# EAGLE design MicroCounter (EAGLE 9.6.2)
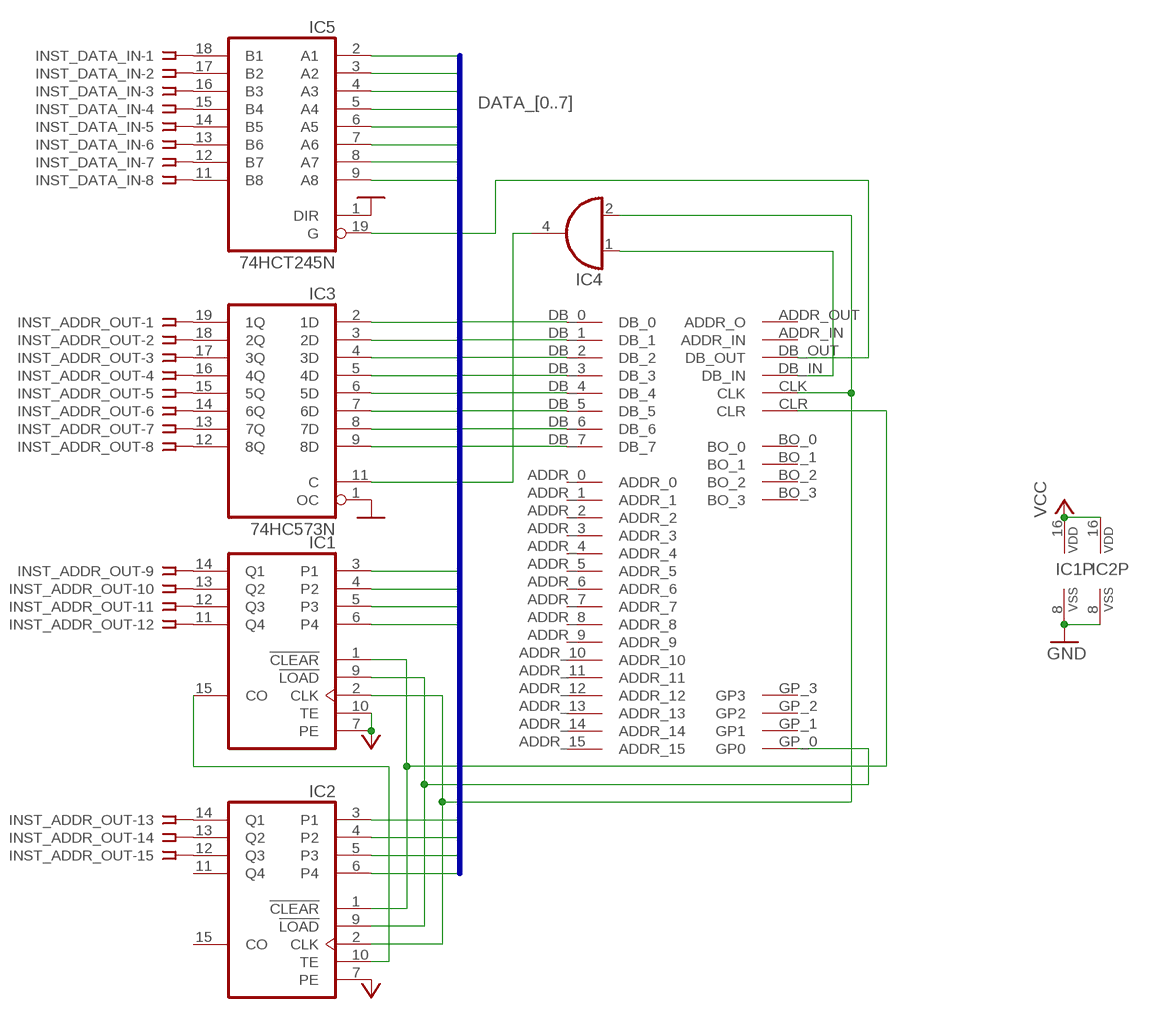
[diagram p0: schematic, sheet 1]

## Parts
IC1  4161N  [DIL16]
IC2  4161N  [DIL16]
IC3  74HC573N  [DIL20]
IC4  74LVC1G08DCK  [SC70-5]
IC5  74HCT245N  [DIL20]
INST_ADDR_OUT  SSW-115-02-G-S  [SSW-115-02-G-S]
INST_DATA_IN  SSW-108-02-G-S  [SSW-108-02-G-S]
U$1  BACKPLATE_INTERFACEEDGE_FINGER  [BACK_INTERFACE-FOOT]

## Nets
DATA_0: IC1.3(P1) IC3.2(1D) IC5.2(A1) U$1.DB_0
DATA_1: IC1.4(P2) IC3.3(2D) IC5.3(A2) U$1.DB_1
DATA_2: IC1.5(P3) IC3.4(3D) IC5.4(A3) U$1.DB_2
DATA_3: IC1.6(P4) IC3.5(4D) IC5.5(A4) U$1.DB_3
DATA_4: IC2.3(P1) IC3.6(5D) IC5.6(A5) U$1.DB_4
DATA_5: IC2.4(P2) IC3.7(6D) IC5.7(A6) U$1.DB_5
DATA_6: IC2.5(P3) IC3.8(7D) IC5.8(A7) U$1.DB_6
DATA_7: IC2.6(P4) IC3.9(8D) IC5.9(A8) U$1.DB_7
GND: IC1.8(VSS) IC2.8(VSS) IC3.1(OC) IC5.1(DIR)
N$1: IC3.19(1Q) INST_ADDR_OUT.1
N$2: IC5.18(B1) INST_DATA_IN.1
N$3: IC5.17(B2) INST_DATA_IN.2
N$4: IC5.16(B3) INST_DATA_IN.3
N$5: IC5.15(B4) INST_DATA_IN.4
N$6: IC3.18(2Q) INST_ADDR_OUT.2
N$7: IC5.14(B5) INST_DATA_IN.5
N$8: IC5.13(B6) INST_DATA_IN.6
N$9: IC5.12(B7) INST_DATA_IN.7
N$10: IC5.11(B8) INST_DATA_IN.8
N$11: IC3.17(3Q) INST_ADDR_OUT.3
N$12: IC3.16(4Q) INST_ADDR_OUT.4
N$13: IC3.15(5Q) INST_ADDR_OUT.5
N$14: IC3.14(6Q) INST_ADDR_OUT.6
N$15: IC3.13(7Q) INST_ADDR_OUT.7
N$16: IC3.12(8Q) INST_ADDR_OUT.8
N$17: IC1.14(Q1) INST_ADDR_OUT.9
N$18: IC1.13(Q2) INST_ADDR_OUT.10
N$19: IC1.12(Q3) INST_ADDR_OUT.11
N$20: IC1.11(Q4) INST_ADDR_OUT.12
N$21: IC2.14(Q1) INST_ADDR_OUT.13
N$22: IC2.13(Q2) INST_ADDR_OUT.14
N$23: IC2.12(Q3) INST_ADDR_OUT.15
N$24: IC3.11(C) IC4.4(O)
N$25: IC1.15(CO) IC2.10(TE)
N$26: IC4.1(I0) U$1.DB_IN
N$27: IC5.19(G) U$1.DB_OUT
N$28: IC1.1(!CLEAR) IC2.1(!CLEAR) U$1.CLR
N$29: IC1.2(CLK) IC2.2(CLK) IC4.2(I1) U$1.CLK
SUB_LOAD: IC1.9(!LOAD) IC2.9(!LOAD) U$1.GP_0(GP0)
VCC: IC1.7(PE) IC1.10(TE) IC1.16(VDD) IC2.7(PE) IC2.16(VDD)
Unconnected: IC2.11(Q4) IC2.15(CO) U$1.ADDR_0 U$1.ADDR_1 U$1.ADDR_2 U$1.ADDR_3 U$1.ADDR_4 U$1.ADDR_5 U$1.ADDR_6 U$1.ADDR_7 U$1.ADDR_8 U$1.ADDR_9 U$1.ADDR_10 U$1.ADDR_11 U$1.ADDR_12 U$1.ADDR_13 U$1.ADDR_14 U$1.ADDR_15 U$1.ADDR_IN U$1.ADDR_OUT(ADDR_O) U$1.BO_0 U$1.BO_1 U$1.BO_2 U$1.BO_3 U$1.GP_1(GP1) U$1.GP_2(GP2) U$1.GP_3(GP3) U$1.NC_0 U$1.NC_1 U$1.NC_2 U$1.NC_3 U$1.NC_4 U$1.NC_5 U$1.NC_6 U$1.NC_7 U$1.NC_8 U$1.NC_9 U$1.NC_10 U$1.NC_11 U$1.NC_12 U$1.NC_13 U$1.NC_14 U$1.NC_15 U$1.NC_16 U$1.NC_17 U$1.NC_18 U$1.NC_19 U$1.NC_20 U$1.NC_21

## Buses
DATA_[0..7]

## Power pins joined to a net without a drawn wire
GND: IC3.10(GND) IC4.3(GND) IC5.10(GND) U$1.GND_0(GND) U$1.GND_1(GND)
VCC: IC3.20(VCC) IC4.5(VCC) IC5.20(VCC) U$1.VCC_0(VCC) U$1.VCC_1(VCC)

## Library data of the parts
IC1 IC2 = 40xx:4161: Synchronous presettable 4-bit binary COUNTER
IC3 = 74xx-eu:74*573: 8-bit D latch BUS DRIVER
IC4 = 74xx-little-de:74*1G08: 2-input AND gate
IC5 = 74xx-eu:74*245: Octal BUS TRANSCEIVER, 3-state
INST_ADDR_OUT = con-samtec:SSW-115-02-G-S: THROUGH-HOLE .025" SQ POST SOCKET Source: Samtec SSW.pdf; MF: Samtec Inc.; MPN: SSW-115-02-G-S; OC_FARNELL: unknown; OC_NEWARK: 11P9564
INST_DATA_IN = con-samtec:SSW-108-02-G-S: THROUGH-HOLE .025" SQ POST SOCKET Source: Samtec SSW.pdf; MF: Samtec Inc.; MPN: SSW-108-02-G-S; OC_FARNELL: unknown; OC_NEWARK: 11P9448
U$1 = Computer:BACKPLATE_INTERFACE

## Board
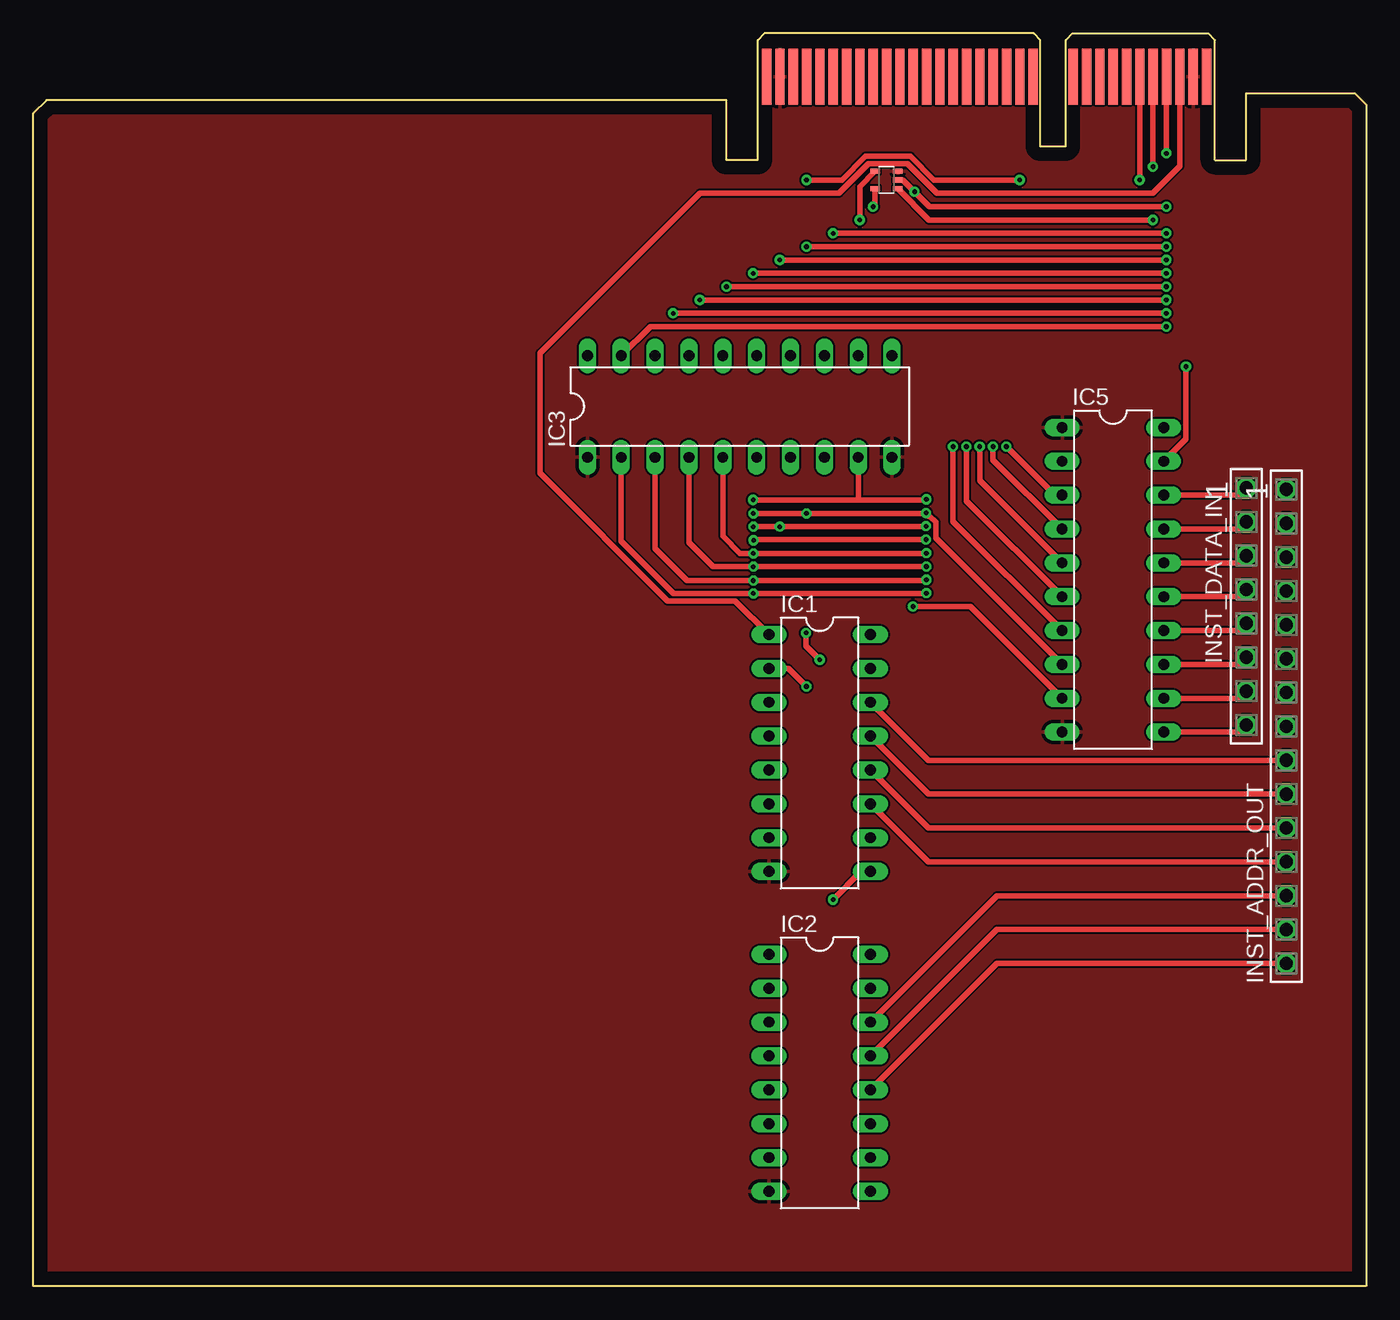
[diagram p1: board, top side]
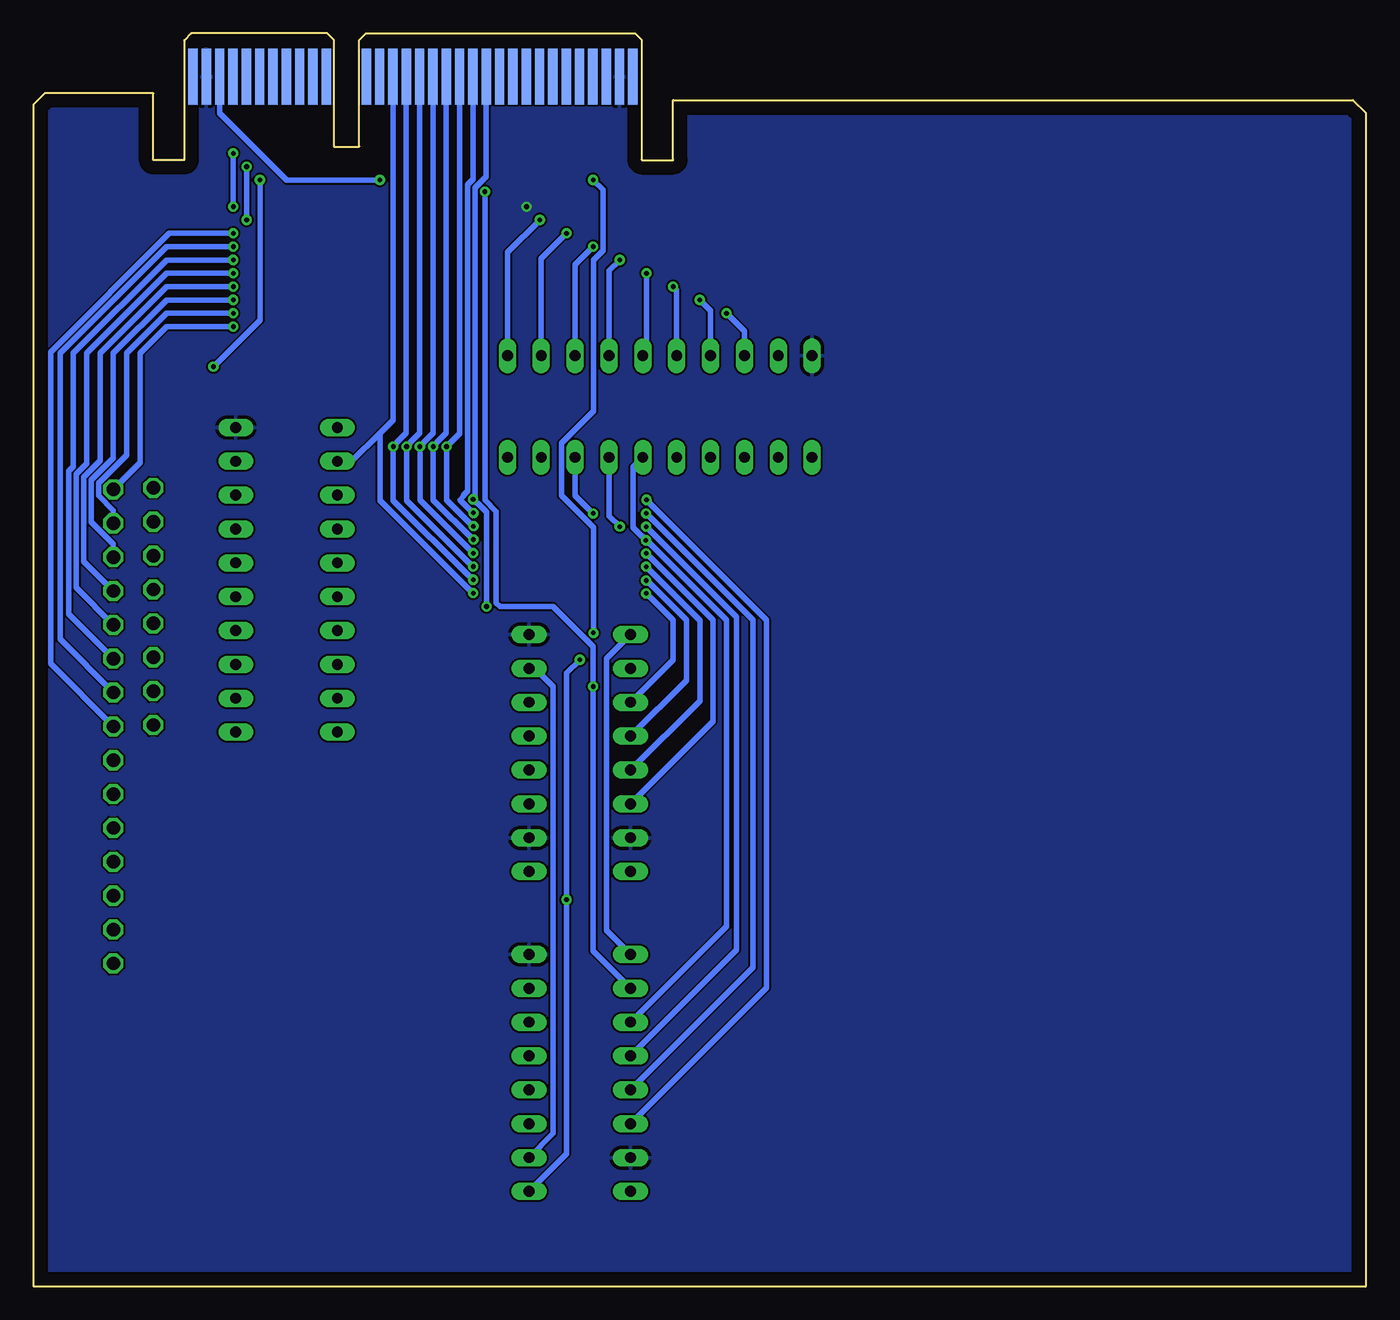
[diagram p2: board, bottom side, seen from below]

Size 100 x 94 mm. Coordinates in mm from the lower left corner, seen from the top.
Outline: 0,0 0,88 1,89 52,89 52,84.5 54.35,84.5 54.35,93.5 54.85,94 75.05,94 75.55,93.5 75.55,85.5 77.45,85.5 77.45,93.5 77.95,94 88.15,94 88.65,93.5 88.65,84.5 91,84.5 91,89.5 99.15,89.5 100,88.65 100,0 0,0
Copper layers (1*16): Top 0.035mm / dielectric 1.5mm / Bottom 0.035mm
Design rules "default *": minimum track width 16mil, minimum drill 0.35mm, track to track 6mil, track to pad 6mil, pad to pad 6mil, via to via 6mil, smd to smd 6mil, copper to edge 40mil, drill to drill 6mil, minimum pad ring 10mil, minimum via ring 8mil, stop-mask expansion 4mil, vias tented up to drill 0mil, thermal gap 10mil

### Footprints (pad centres in the part's own frame; a part is rotated, then mirrored left to right if it is on the bottom)
DIL16 = drill 0.813 long: 1 -8.89,-3.81; 2 -6.35,-3.81; 3 -3.81,-3.81; 4 -1.27,-3.81; 5 1.27,-3.81; 6 3.81,-3.81; 7 6.35,-3.81; 8 8.89,-3.81; 9 8.89,3.81; 10 6.35,3.81; 11 3.81,3.81; 12 1.27,3.81; 13 -1.27,3.81; 14 -3.81,3.81; 15 -6.35,3.81; 16 -8.89,3.81
DIL20 = drill 0.813 long: 1 -11.43,-3.81; 2 -8.89,-3.81; 3 -6.35,-3.81; 4 -3.81,-3.81; 5 -1.27,-3.81; 6 1.27,-3.81; 7 3.81,-3.81; 8 6.35,-3.81; 9 8.89,-3.81; 10 11.43,-3.81; 11 11.43,3.81; 12 8.89,3.81; 13 6.35,3.81; 14 3.81,3.81; 15 1.27,3.81; 16 -1.27,3.81; 17 -3.81,3.81; 18 -6.35,3.81; 19 -8.89,3.81; 20 -11.43,3.81
SC70-5 = smd 0.4 x 0.7: 1 -0.65,-0.85; 2 0,-0.85; 3 0.65,-0.85; 4 0.65,0.85; 5 -0.65,0.85
SSW-115-02-G-S = drill 1 pad 1.5 octagon: 1 -17.78,0; 2 -15.24,0; 3 -12.7,0; 4 -10.16,0; 5 -7.62,0; 6 -5.08,0; 7 -2.54,0; 8 0,0; 9 2.54,0; 10 5.08,0; 11 7.62,0; 12 10.16,0; 13 12.7,0; 14 15.24,0; 15 17.78,0
SSW-108-02-G-S = drill 1 pad 1.5 octagon: 1 -8.89,0; 2 -6.35,0; 3 -3.81,0; 4 -1.27,0; 5 1.27,0; 6 3.81,0; 7 6.35,0; 8 8.89,0
BACK_INTERFACE-FOOT = smd 0.7 x 4.2: ADDR_0 17.02,0; ADDR_1 16.02,0; ADDR_2 15.02,0; ADDR_3 14.02,0; ADDR_4 13.02,0; ADDR_5 12.02,0; ADDR_6 11.02,0; ADDR_7 10.02,0; ADDR_8 9.02,0; ADDR_9 8.02,0; ADDR_10 7.02,0; ADDR_11 6.02,0; ADDR_12 5.02,0; ADDR_13 4.02,0; ADDR_14 3.02,0; ADDR_15 2.02,0; ADDR_IN 27.02,0; ADDR_OUT 26.02,0; CLK 30.02,0; CLR 31.02,0; DB_IN 29.02,0; DB_OUT 28.02,0; GND_0 32.02,0; GND_1 1.02,0; NC_0 33.02,0; NC_1 25.02,0; NC_2 24.02,0; NC_3 23.02,0; NC_4 20.02,0; NC_5 19.02,0; NC_6 18.02,0; NC_7 0.02,0 | smd 0.7 x 4.2 bottom: BO_0 27.02,0; BO_1 26.02,0; BO_2 25.02,0; BO_3 24.02,0; DB_0 18.02,0; DB_1 17.02,0; DB_2 16.02,0; DB_3 15.02,0; DB_4 14.02,0; DB_5 13.02,0; DB_6 12.02,0; DB_7 11.02,0; GP_0 31.02,0; GP_1 30.02,0; GP_2 29.02,0; GP_3 28.02,0; NC_8 33.02,0; NC_9 23.02,0; NC_10 20.02,0; NC_11 19.02,0; NC_12 10.02,0; NC_13 9.02,0; NC_14 8.02,0; NC_15 7.02,0; NC_16 6.02,0; NC_17 5.02,0; NC_18 4.02,0; NC_19 3.02,0; NC_20 2.02,0; NC_21 0.02,0; VCC_0 32.02,0; VCC_1 1.02,0

### Placement (x,y rotation side)
IC1  59,40 270 top
IC2  59,16 270 top
IC3  53,66 0 top
IC4  64,83 90 top
IC5  81,53 270 top
INST_ADDR_OUT  94,42 270 top
INST_DATA_IN  91,51 270 top
U$1  55,90.75 0 top

### Tracks (layer width: path | path; a pad name or v marks a point on that pad's centre or on a via)
DATA_0  (via drill 0.35)
  Top 0.406: v67,52 66.98,51.98 v54.02,51.98 48.02,51.98 44.11,55.89 IC3.2
  Bottom 0.406: 74,64 74,58.96 67.3,52.27 67.27,52.27 v67,52 | IC1.3 52,47 52,50 53.98,51.98 v54.02,51.98 | IC5.2 76.11,61.89 74,64 | 74,64 73.02,64.98 U$1.DB_0
DATA_1  (via drill 0.35)
  Top 0.406: v67,53 66.94,52.94 v54.02,52.94 49.06,52.94 46.65,55.35 IC3.3 | IC5.3 76.65,59.35 v73,63
  Bottom 0.406: IC1.4 51,45.46 51,50 53.98,52.98 v54.02,52.94 | v67,53 67.27,53.27 67.3,53.27 73,58.96 v73,63 72.73,63.27 72.73,63.3 72.02,64.02 U$1.DB_1
DATA_2  (via drill 0.35)
  Top 0.406: v67,54 54.04,54 | 54.04,54 v54.02,53.98 | IC3.4 49.19,55.81 51,54 54.04,54 | IC5.4 72,62 v72,63
  Bottom 0.406: 55.19,39.17 IC1.5 50,43.92 50,49.96 v54.02,53.98 | v67,54 67.27,54.27 67.3,54.27 72,58.96 v72,63 71.73,63.27 71.73,63.3 71.02,64.02 U$1.DB_2
DATA_3  (via drill 0.35)
  Top 0.406: v67,55 66.98,54.98 v54.02,54.98 53.02,54.98 51.73,56.27 IC3.5 | IC5.5 71,60.46 v71,63
  Bottom 0.406: IC1.6 49,42.38 49,50 53.98,54.98 v54.02,54.98 | v67,55 71,59 v71,63 70.73,63.27 70.73,63.3 70.02,64.02 U$1.DB_3
DATA_4  (via drill 0.35)
  Top 0.406: v54.04,55.96 54.09,56.02 v66.98,56.02 | IC5.6 70,58.92 v70,63
  Bottom 0.406: IC2.3 48,27 48,50 53.96,55.96 | 66.94,56.02 v66.98,56.02 67.02,56.02 70,59 v70,63 69.73,63.27 69.73,63.3 69.02,64.02 U$1.DB_4 | 53.96,55.96 v54.04,55.96 | IC3.6 55,61.46 55,56.92 54.32,56.25 54.25,56.25 53.96,55.96
DATA_5  (via drill 0.35)
  Top 0.406: v66.98,57.02 66.94,56.98 v56,56.98 v54.02,56.98 | IC5.7 69,57.38 v69,63
  Bottom 0.406: IC2.4 47.23,25.23 47.23,50.19 v54.02,56.98 | v66.98,57.02 67,57 69,59 v69,63 68.02,63.98 U$1.DB_5 | IC3.7 56.81,57.79 v56,56.98
DATA_6  (via drill 0.35)
  Top 0.406: v54.02,57.98 v58,57.98 66.94,57.98 v66.98,58.02 67.25,57.75 67.28,57.75 67.72,57.32 67.72,56.12 IC5.8
  Bottom 0.406: IC2.5 46,23.92 46,50 53.98,57.98 v54.02,57.98 | v66.98,58.02 67.02,58.02 68,59 67.73,59.27 67.73,59.34 67.41,59.67 67.41,82.65 67.02,83.05 U$1.DB_6 | IC3.8 59.35,59.33 v58,57.98
DATA_7  (via drill 0.35)
  Top 0.406: v67,59.04 66.96,59 62,59 | 62,59 v54,59 | IC3.9 61.89,59.11 62,59 | IC5.9 70.3,51 v66,51
  Bottom 0.406: v54,59 45,50 45,22.38 IC2.6 | v66,51 66,58.08 66.68,58.75 66.75,58.75 67.02,59.02 v67,59.04 66.85,59.19 66.85,82.42 66.02,83.25 U$1.DB_7
GND
  pour Top: 0,88 1,89 52,89 52,84.5 54.35,84.5 54.35,93.5 54.85,94 75.05,94 75.55,93.5 75.55,85.5 77.45,85.5 77.45,93.5 77.95,94 88.15,94 88.65,93.5 88.65,84.5 91,84.5 91,89.5 99.15,89.5 100,88.65 100,0 0,0
N$1  (via drill 0.35)
  Top 0.406: IC3.19 46.3,72 v85,72
  Bottom 0.406: INST_ADDR_OUT.1 92,61.78 92,70 90,72 v85,72
N$2
  Top 0.406: INST_DATA_IN.1 90.46,59.35 IC5.18
N$3
  Top 0.406: INST_DATA_IN.2 90.46,56.81 IC5.17
N$4
  Top 0.406: INST_DATA_IN.3 90.46,54.27 IC5.16
N$5
  Top 0.406: INST_DATA_IN.4 90.46,51.73 IC5.15
N$6  (via drill 0.35)
  Top 0.406: v85,73 v48,73
  Bottom 0.406: INST_ADDR_OUT.2 94,58.21 95.11,59.32 95.11,60.24 93,62.35 93,70 90,73 v85,73 | v48,73 46.65,71.65 IC3.18
N$7
  Top 0.406: INST_DATA_IN.5 90.46,49.19 IC5.14
N$8
  Top 0.406: INST_DATA_IN.6 90.46,46.65 IC5.13
N$9
  Top 0.406: INST_DATA_IN.7 90.46,44.11 IC5.12
N$10
  Top 0.406: INST_DATA_IN.8 90.46,41.57 IC5.11
N$11  (via drill 0.35)
  Top 0.406: v85,74 v50,74
  Bottom 0.406: INST_ADDR_OUT.3 94,55.67 95.67,57.34 95.67,60.47 94,62.14 94,70 90,74 v85,74 | v50,74 49.19,73.19 IC3.17
N$12  (via drill 0.35)
  Top 0.406: v85,75 v52,75
  Bottom 0.406: INST_ADDR_OUT.4 96.23,54.39 96.23,60.7 95,61.93 95,70 90,75 v85,75 | v52,75 51.73,74.73 IC3.16
N$13  (via drill 0.35)
  Top 0.406: v85,76 v54,76
  Bottom 0.406: INST_ADDR_OUT.5 96.79,52.41 96.79,60.93 96,61.72 96,70 90,76 v85,76 | v54,76 54,70.08 IC3.15
N$14  (via drill 0.35)
  Top 0.406: v56,77 v85,77
  Bottom 0.406: INST_ADDR_OUT.6 97.34,50.42 97.34,61.16 97,61.51 97,70 90,77 v85,77 | v56,77 56.81,76.19 IC3.14
N$15  (via drill 0.35)
  Top 0.406: v85,78 v58,78
  Bottom 0.406: INST_ADDR_OUT.7 98,48.54 98,70 90,78 v85,78 | v58,78 59.35,76.65 IC3.13
N$16  (via drill 0.35)
  Top 0.406: v60,79 v85,79
  Bottom 0.406: INST_ADDR_OUT.8 98.7,46.7 98.7,70.09 89.79,79 v85,79 | v60,79 61.89,77.11 IC3.12
N$17
  Top 0.406: INST_ADDR_OUT.9 67.16,39.46 IC1.14
N$18
  Top 0.406: INST_ADDR_OUT.10 67.16,36.92 IC1.13
N$19
  Top 0.406: INST_ADDR_OUT.11 67.16,34.38 IC1.12
N$20
  Top 0.406: INST_ADDR_OUT.12 67.16,31.84 IC1.11
N$21
  Top 0.406: INST_ADDR_OUT.13 72.3,29.3 IC2.14
N$22
  Top 0.406: INST_ADDR_OUT.14 72.3,26.76 IC2.13
N$23
  Top 0.406: INST_ADDR_OUT.15 72.3,24.22 IC2.12
N$24  (via drill 0.35)
  Top 0.406: v62,80 62,82.5 IC4.4
  Bottom 0.406: IC3.11 64.43,77.57 v62,80
N$25
  Bottom 0.406: IC2.10 61,11.46 61,45 62.35,46.35 IC1.15
N$26  (via drill 0.35)
  Top 0.406: IC4.1 67.2,80 v84,80 | v84,84 84,90.73 U$1.DB_IN
  Bottom 0.406: v84,80 v84,84
N$27  (via drill 0.35)
  Top 0.406: IC5.19 86.49,63.57 v86.49,69 | U$1.DB_OUT 83,90.73 v83,83
  Bottom 0.406: v83,83 83,72.49 v86.49,69
N$28
  Top 0.406: IC1.1 52.66,51.42 47.58,51.42 38,61 38,70 50,82 60.45,82 62.66,84.21 65.58,84.21 67.79,82 84,82 86.02,84.02 U$1.CLR
  Bottom 0.406: IC2.1 57,26.7 57,47.08 IC1.1
N$29  (via drill 0.35)
  Top 0.406: v58,45 56.65,46.35 IC1.2 | IC4.2 65.25,83 65.56,82.7 65.56,82.68 v66.12,82.12 67.24,81 v85,81 | v85,85 85,90.73 U$1.CLK
  Bottom 0.406: IC2.2 58,25.16 v58,45 58,48 61,51 65,51 65.27,51.27 65.27,58.13 66.12,58.98 v66.12,82.12 | v85,81 v85,85
SUB_LOAD  (via drill 0.35)
  Top 0.406: v60,29 62.11,31.11 IC1.9 | v59,47 57.98,48.02 v57.98,49.02 | v74,83 67.58,83 65.81,84.77 62.42,84.77 60.66,83 v58,83
  Bottom 0.406: IC2.9 60,9.92 v60,29 60,46 v59,47 | v57.98,49.02 57.98,56.92 60.37,59.31 60.37,63.27 57.98,65.66 57.98,76.98 57.27,77.7 57.27,82.27 v58,83 | U$1.GP_0 86.02,88.02 81,83 v74,83
VCC  (via drill 0.35)
  Top 0.406: IC4.5 63.15,81.15 v63,81
  pour Bottom: 0,88 1,89 52,89 52,84.5 54.35,84.5 54.35,93.5 54.85,94 75.05,94 75.55,93.5 75.55,85.5 77.45,85.5 77.45,93.5 77.95,94 88.15,94 88.65,93.5 88.65,84.5 91,84.5 91,89.5 99.15,89.5 100,88.65 100,0 0,0